# EAGLE design FluxamasynthStandalone_v1 (EAGLE 5.06)
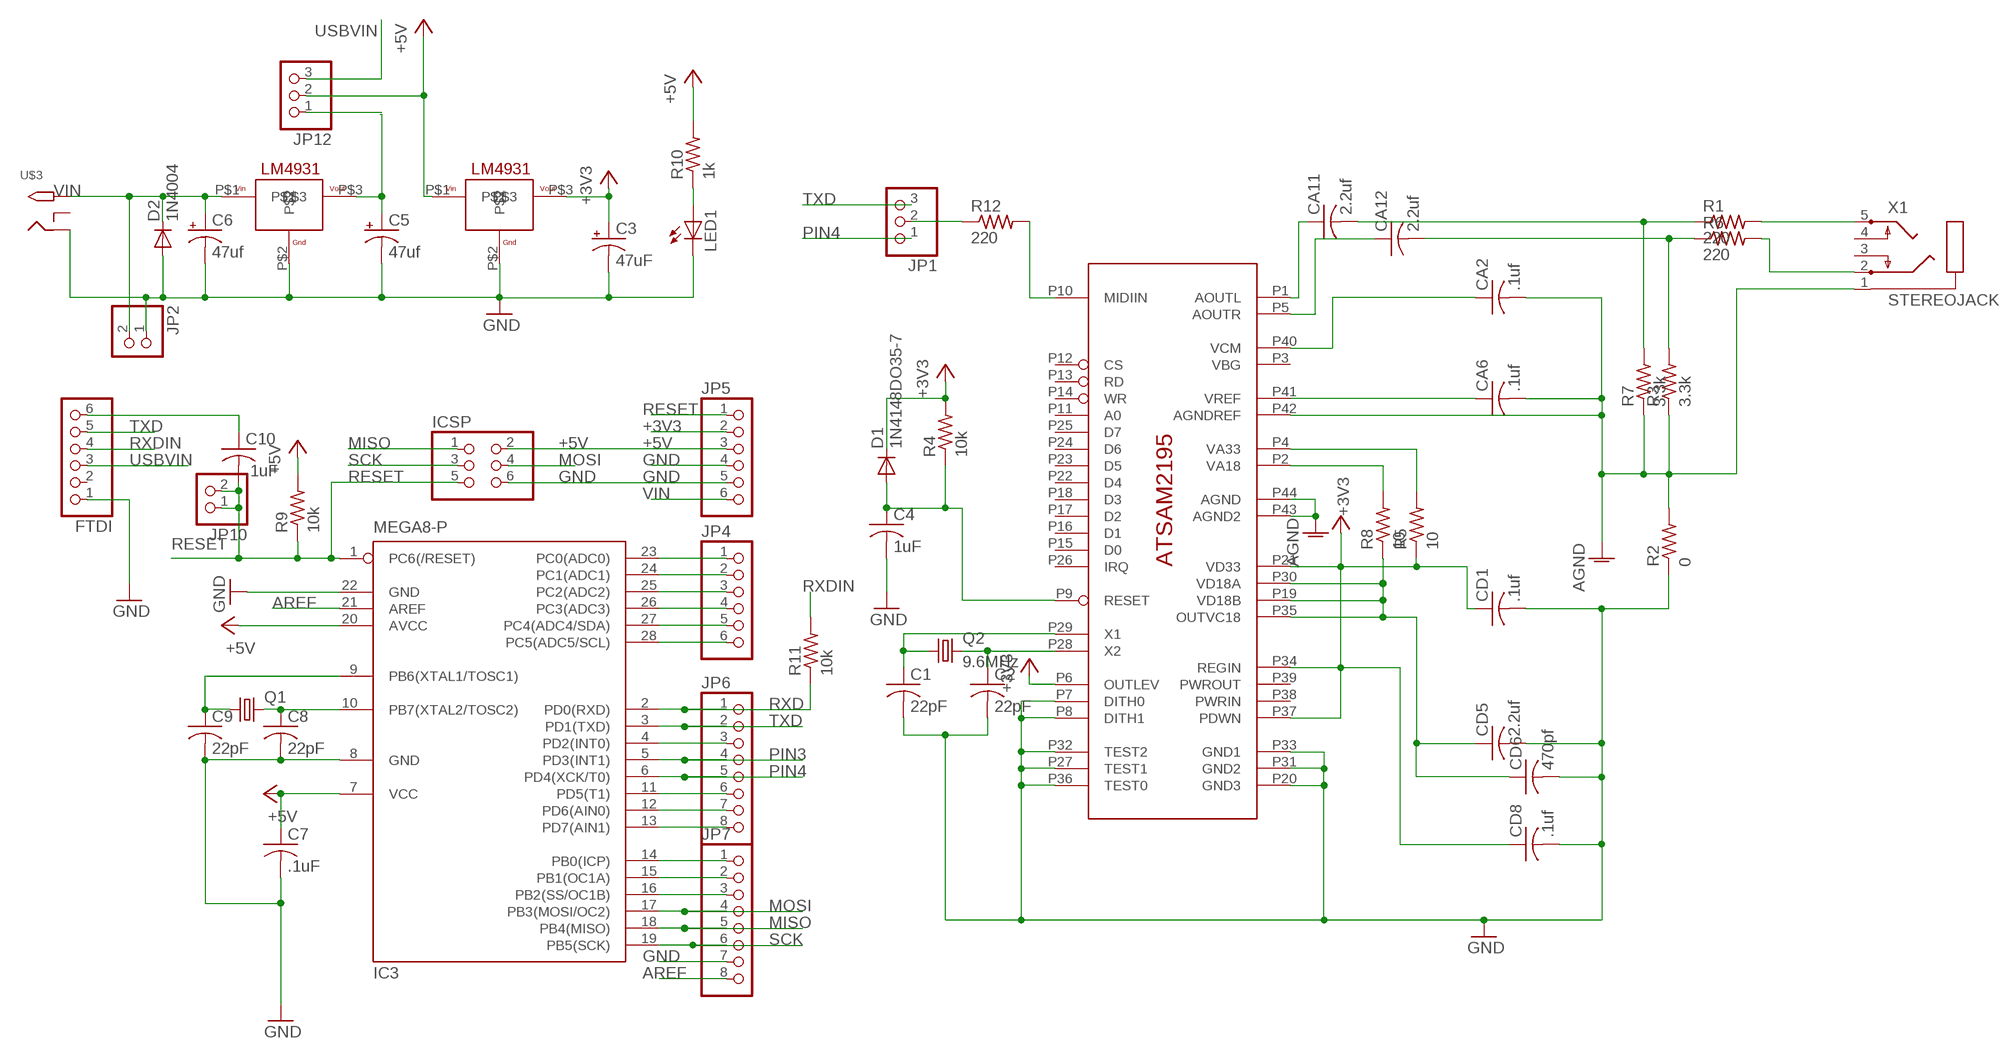
[diagram p0: schematic, sheet 1]

## Parts
C1  22pF  C-US025-025X050  [C025-025X050]
C2  22pF  C-US025-025X050  [C025-025X050]
C3  47uF  CPOL-USTT2D6  [TT2D6]
C4  1uF  C-US025-025X050  [C025-025X050]
C5  47uf  CPOL-USTT2D6  [TT2D6]
C6  47uf  CPOL-USTT2D6  [TT2D6]
C7  .1uF  C-US025-025X050  [C025-025X050]
C8  22pF  C-US025-025X050  [C025-025X050]
C9  22pF  C-US025-025X050  [C025-025X050]
C10  .1uF  C-US025-025X050  [C025-025X050]
CA2  .1uf  C-US025-025X050  [C025-025X050]
CA6  .1uf  C-US025-025X050  [C025-025X050]
CA11  2.2uf  C-US025-025X050  [C025-025X050]
CA12  2.2uf  C-US025-025X050  [C025-025X050]
CD1  .1uf  C-US025-025X050  [C025-025X050]
CD5  2.2uf  C-US025-025X050  [C025-025X050]
CD6  470pf  C-US025-025X050  [C025-025X050]
CD8  .1uf  C-US025-025X050  [C025-025X050]
D1  1N4148DO35-7  [DO35-7]
D2  1N4004  [DO41-10]
FTDI  PINHD-1X6  [1X06]
IC3  MEGA8-P  [DIL28-3]
ICSP  PINHD-2X3  [2X03]
JP1  PINHD-1X3  [1X03]
JP2  PINHD-1X2  [1X02]
JP4  PINHD-1X6  [1X06]
JP5  PINHD-1X6  [1X06]
JP6  PINHD-1X8  [1X08]
JP7  PINHD-1X8  [1X08]
JP10  PINHD-1X2  [1X02]
JP12  PINHD-1X3  [1X03]
LED1  LED3MM  [LED3MM]
Q1  CRYSTALHC49S  [HC49/S]
Q2  9.6MHz  CRYSTALTC26H  [TC26H]
R1  220  R-US_0207/7  [0207/7]
R2  0  R-US_0207/7  [0207/7]
R3  3.3k  R-US_0207/7  [0207/7]
R4  10k  R-US_0207/7  [0207/7]
R5  10  R-US_0207/7  [0207/7]
R6  220  R-US_0207/7  [0207/7]
R7  3.3k  R-US_0207/7  [0207/7]
R8  10  R-US_0207/7  [0207/7]
R9  10k  R-US_0207/7  [0207/7]
R10  1k  R-US_0207/7  [0207/7]
R11  10k  R-US_0207/7  [0207/7]
R12  220  R-US_0207/7  [0207/7]
U$1  ATSAM2195  [ATSAM2195]
U$2  LM4931  [LM4931TO92]
U$3  2.1MMJACK  [PJ-102A]
U$4  LM4931  [LM4931TO92]
X1  STEREOJACK  [STX3100]

## Nets
+3V3: C3.+ CD1.1 CD8.1 D1.C JP5.2 R4.2 R5.1 U$1.P6(OUTLEV) U$1.P21(VD33) U$1.P34(REGIN) U$1.P37(PDWN) U$4.P$3
+5V: C7.1 IC3.7(VCC) IC3.20(AVCC) ICSP.2 JP5.3 JP12.2 R9.2 R10.2 U$4.P$1
AGND: CA2.2 CA6.2 R2.2 R3.1 R7.1 U$1.P42(AGNDREF) U$1.P43(AGND2) U$1.P44(AGND) X1.1
AREF: IC3.21(AREF) JP7.8
CA11: CA12.1 U$1.P5(AOUTR)
GND: C1.2 C2.2 C3.- C4.2 C5.- C6.- C7.2 C8.2 C9.2 CD1.2 CD5.2 CD6.2 CD8.2 D2.A FTDI.1 IC3.8(GND) IC3.22(GND) ICSP.6 JP2.1 JP5.4 JP5.5 JP7.7 LED1.K(C) R2.1 U$1.P7(DITH0) U$1.P8(DITH1) U$1.P20(GND3) U$1.P27(TEST1) U$1.P31(GND2) U$1.P32(TEST2) U$1.P33(GND1) U$1.P36(TEST0) U$2.P$2 U$3.RING U$4.P$2
MISO: IC3.18(PB4(MISO)) ICSP.1 JP7.5
MOSI: IC3.17(PB3(MOSI/OC2)) ICSP.4 JP7.4
N$1: JP1.2 R12.1
N$2: R12.2 U$1.P10(MIDIIN)
N$3: C2.1 Q2.2 U$1.P28(X2)
N$4: C4.1 D1.A R4.1 U$1.P9(RESET)
N$5: C1.1 Q2.1 U$1.P29(X1)
N$6: CD5.1 CD6.1 R8.1 U$1.P19(VD18B) U$1.P30(VD18A) U$1.P35(OUTVC18)
N$7: R8.2 U$1.P2(VA18)
N$8: CA11.1 U$1.P1(AOUTL)
N$9: LED1.A R10.1
N$10: CA11.2 R1.1 R7.2
N$11: CA12.2 R3.2 R6.1
N$12: CA2.1 U$1.P40(VCM)
N$13: R5.2 U$1.P4(VA33)
N$14: R1.2 X1.5
N$15: IC3.23(PC0(ADC0)) JP4.1
N$16: R6.2 X1.2
N$17: C8.1 IC3.10(PB7(XTAL2/TOSC2)) Q1.2
N$18: JP12.1
N$19: C5.+ U$2.P$3
N$20: CA6.1 U$1.P41(VREF)
N$22: IC3.24(PC1(ADC1)) JP4.2
N$25: C9.1 IC3.9(PB6(XTAL1/TOSC1)) Q1.1
N$26: IC3.25(PC2(ADC2)) JP4.3
N$27: IC3.26(PC3(ADC3)) JP4.4
N$28: IC3.27(PC4(ADC4/SDA)) JP4.5
N$30: IC3.28(PC5(ADC5/SCL)) JP4.6
N$33: IC3.4(PD2(INT0)) JP6.3
N$34: C10.1 FTDI.6
N$36: IC3.11(PD5(T1)) JP6.6
N$37: IC3.12(PD6(AIN0)) JP6.7
N$38: IC3.13(PD7(AIN1)) JP6.8
N$39: IC3.14(PB0(ICP)) JP7.1
N$40: IC3.15(PB1(OC1A)) JP7.2
N$41: IC3.16(PB2(SS/OC1B)) JP7.3
PIN3: IC3.5(PD3(INT1)) JP6.4
PIN4: IC3.6(PD4(XCK/T0)) JP1.1 JP6.5
RESET: C10.2 IC3.1(PC6(/RESET)) ICSP.5 JP5.1 JP10.1 JP10.2 R9.1
RXD: IC3.2(PD0(RXD)) JP6.1 R11.1
RXDIN: FTDI.4 R11.2
SCK: IC3.19(PB5(SCK)) ICSP.3 JP7.6
TXD: FTDI.5 IC3.3(PD1(TXD)) JP1.3 JP6.2
USBVIN: FTDI.3 JP12.3
VIN: C6.+ D2.C JP2.2 JP5.6 U$2.P$1 U$3.TIP
Unconnected: FTDI.2 U$1.P3(VBG) U$1.P11(A0) U$1.P12(CS) U$1.P13(RD) U$1.P14(WR) U$1.P15(D0) U$1.P16(D1) U$1.P17(D2) U$1.P18(D3) U$1.P22(D4) U$1.P23(D5) U$1.P24(D6) U$1.P25(D7) U$1.P26(IRQ) U$1.P38(PWRIN) U$1.P39(PWROUT) U$3.RING_SW X1.3 X1.4

## Library data of the parts
C1 C2 C4 C7-C10 CA2 CA6 CA11 CA12 CD1 CD5 CD6 CD8 = adafruit:C-US: CAPACITOR, American symbol
C3 C5 C6 = adafruit:CPOL-US: POLARIZED CAPACITOR, American symbol
D1 = diode:1N4148: DIODE high speed (Philips)
D2 = adafruit:1N4004: DIODE General purpose 1N400x type rectifier (With bigger pads) http://www.ladyada.net/library/pcb/eaglelibrary.html
FTDI JP4 JP5 = pinhead:PINHD-1X6: PIN HEADER
IC3 = atmel:MEGA8-P: MICROCONTROLLER 8 Kbytes FLASH, 1 kbytes SRAM, 512 bytes EEPROM, USART, 4-channel 10 bit ADC, 2-channel 8 bit ADC Pin compatible with Atmega48, ATMega88, ATMega168 Source: avr.lbr
ICSP = pinhead:PINHD-2X3: PIN HEADER
JP1 JP12 = pinhead:PINHD-1X3: PIN HEADER
JP2 JP10 = pinhead:PINHD-1X2: PIN HEADER
JP6 JP7 = pinhead:PINHD-1X8: PIN HEADER
LED1 = led:LED: LED OSRAM: - CHIPLED LG R971, LG N971, LY N971, LG Q971, LY Q971, LO R971, LY R971 LH N974, LH R974 LS Q976, LO Q976, LY Q976 LO Q996 - Hyper CHIPLED LW Q18S LB Q993, LB Q99A, LB R99A - SideLED LS A670, LO A670, LY A670, LG A670, LP A670 LB A673, LV A673, LT A673, LW A673 LH A674 LY A675 LS A676, LA A676, LO A676, LY A676, LW A676 LS A679, LY A679, LG A679 - Hyper Micro SIDELED® LS Y876, LA Y876, LO Y876, LY Y876 LT Y87S - SmartLED LW L88C, LW L88S LB L89C, LB L89S, LG L890 LS L89K, LO L89K, LY L89K LS L896, LA L896, LO L896, LY L896 - TOPLED LS T670, LO T670, LY T670, LG T670, LP T670 LSG T670, LSP T670, LSY T670, LOP T670, LYG T670 LG T671, LOG T671, LSG T671 LB T673, LV T673, LT T673, LW T673 LH T674 LS T676, LA T676, LO T676, LY T676, LB T676, LH T676, LSB T676, LW T676 LB T67C, LV T67C, LT T67C, LS T67K, LO T67K, LY T67K, LW E67C LS E67B, LA E67B, LO E67B, LY E67B, LB E67C, LV E67C, LT E67C LW T67C LS T679, LY T679, LG T679 LS T770, LO T770, LY T770, LG T770, LP T770 LB T773, LV T773, LT T773, LW T773 LH T774 LS E675, LA E675, LY E675, LS T675 LS T776, LA T776, LO T776, LY T776, LB T776 LHGB T686 LT T68C, LB T68C - Hyper Mini TOPLED® LB M676 - Mini TOPLED Santana® LG M470 LS M47K, LO M47K, LY M47K Source: http://www.osram.convergy.de LUXEON: - LUMILED® LXK2-PW12-R00, LXK2-PW12-S00, LXK2-PW14-U00, LXK2-PW14-V00 LXK2-PM12-R00, LXK2-PM12-S00, LXK2-PM14-U00 LXK2-PE12-Q00, LXK2-PE12-R00, LXK2-PE12-S00, LXK2-PE14-T00, LXK2-PE14-U00 LXK2-PB12-K00, LXK2-PB12-L00, LXK2-PB12-M00, LXK2-PB14-N00, LXK2-PB14-P00, LXK2-PB14-Q00 LXK2-PR12-L00, LXK2-PR12-M00, LXK2-PR14-Q00, LXK2-PR14-R00 LXK2-PD12-Q00, LXK2-PD12-R00, LXK2-PD12-S00 LXK2-PH12-R00, LXK2-PH12-S00 LXK2-PL12-P00, LXK2-PL12-Q00, LXK2-PL12-R00 Source: www.luxeon.com KINGBRIGHT: KA-3528ASYC Source: www.kingbright.com
Q1 Q2 = crystal:CRYSTAL: CRYSTAL
R1-R12 = adafruit:R-US_: RESISTOR, American symbol
U$1 = ATSAM2195:ATSAM2195
U$2 U$4 = LM4931:LM4931
U$3 = adafruit:2.1MMJACK: 2.1mm x 5.5mm DC jack with internal switch. Digikey part #PJ-102A, 4UCON part #05537 By microbuilder.eu
X1 = adafruit:STEREOJACK: MIC/HEADPHONE JACK Stereo jack with two switches. Kycon STX3100, CUI SJ1-3555NG and/or 4UCon 05544

## Board
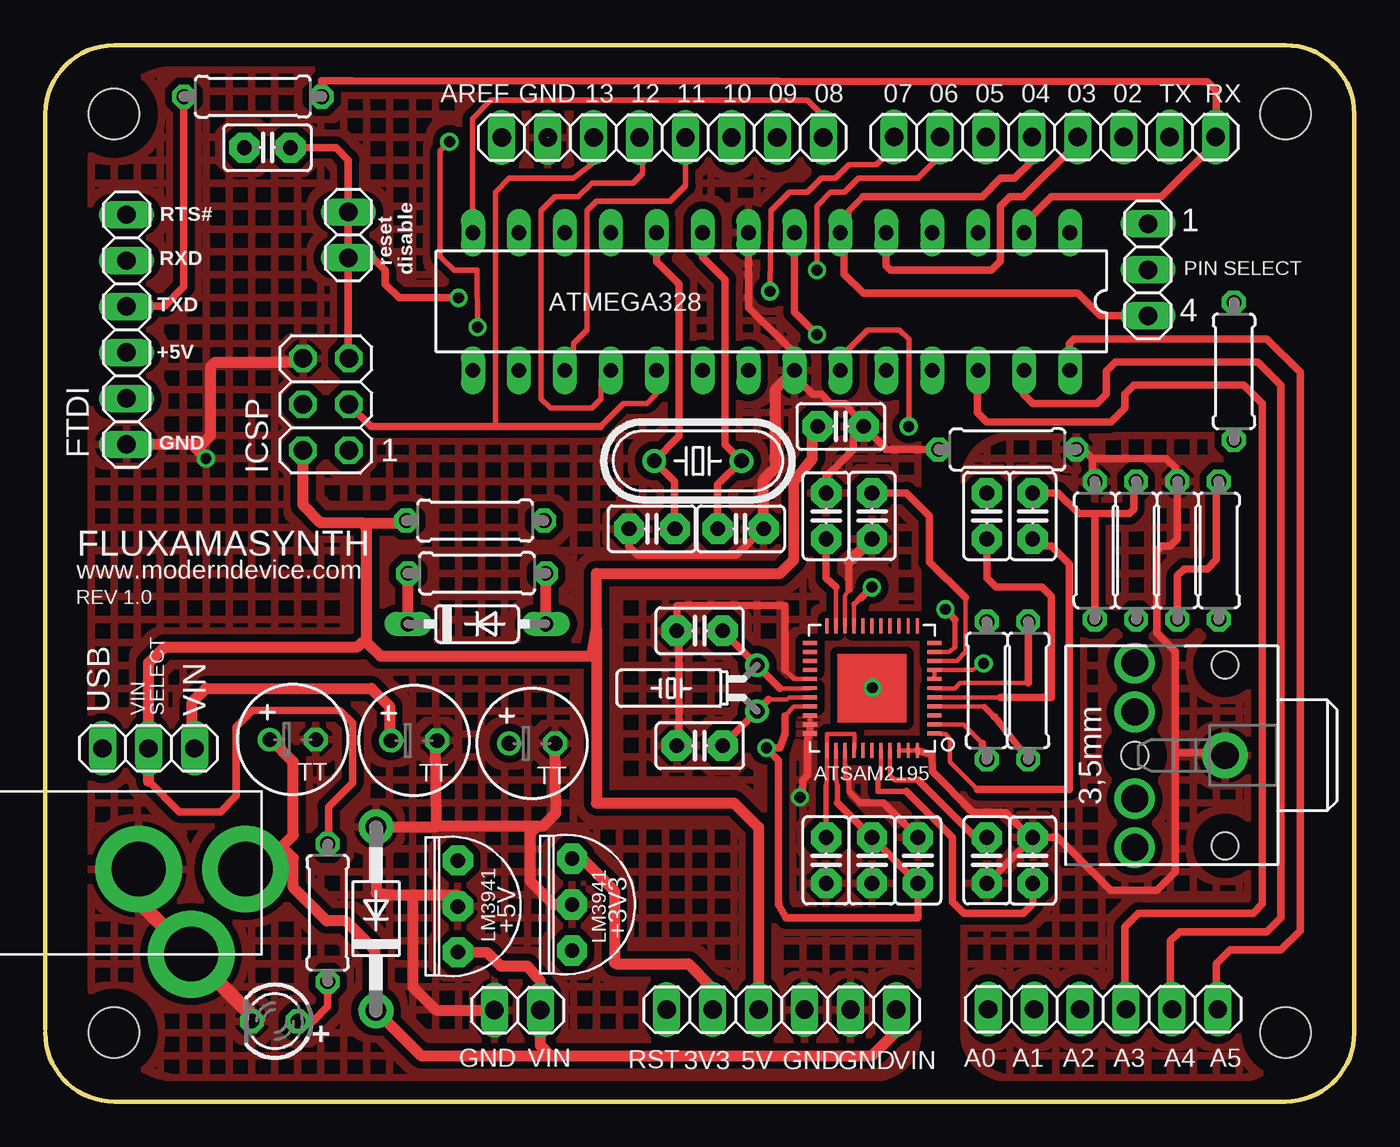
[diagram p1: board, top side]
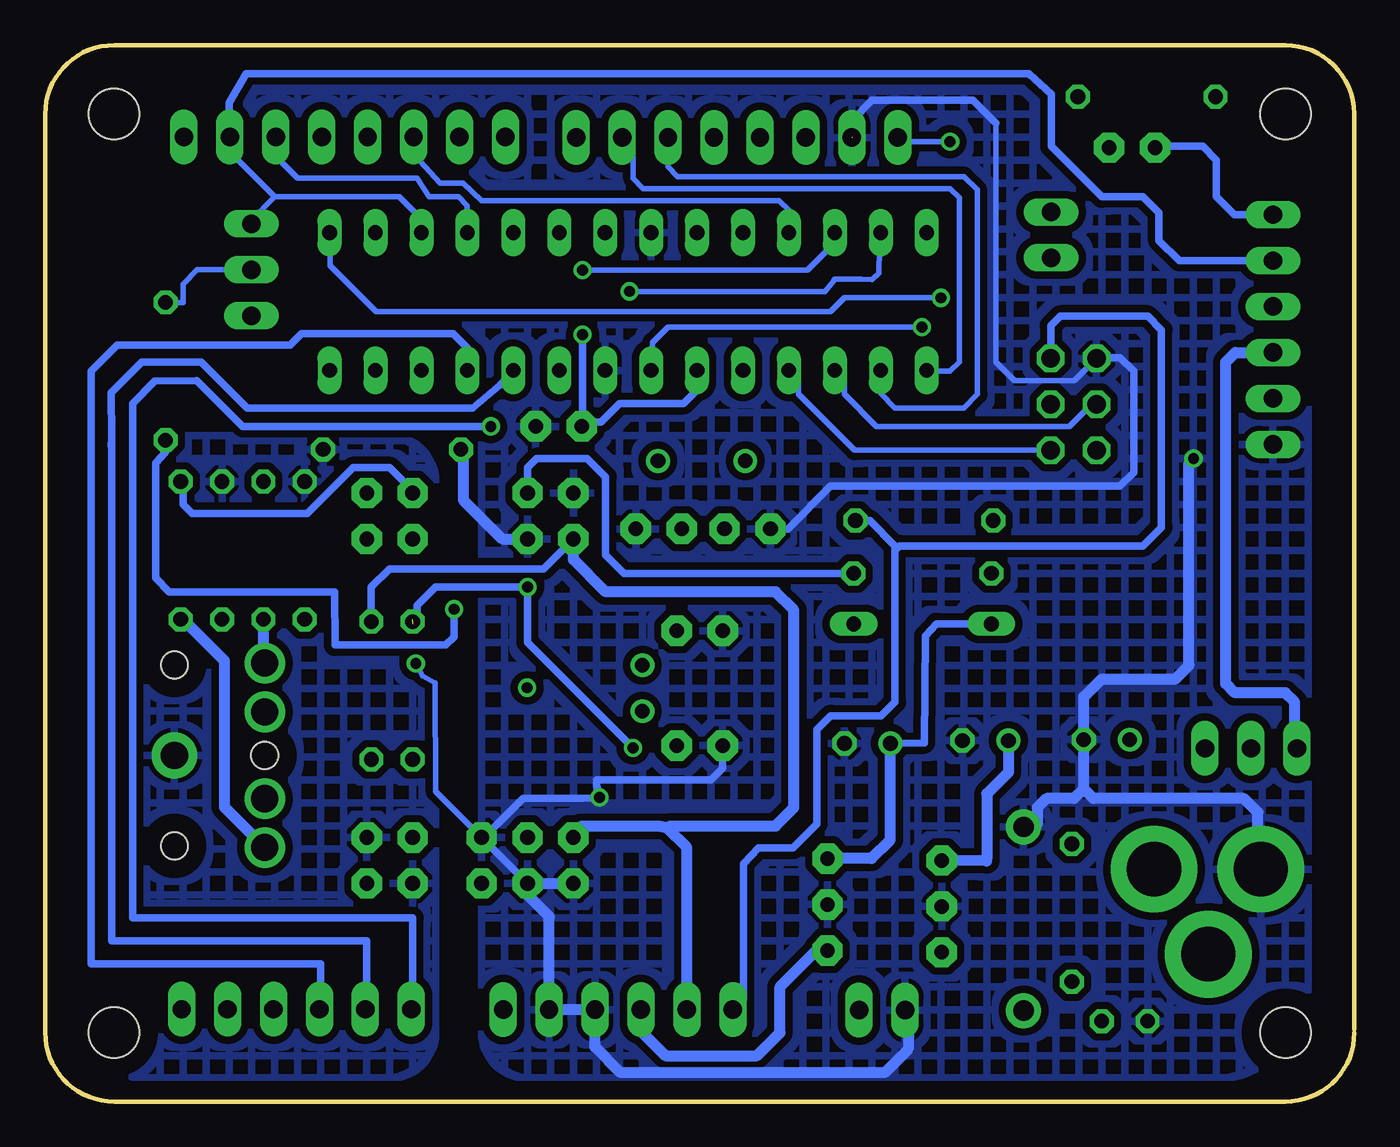
[diagram p2: board, bottom side, seen from below]

Size 72.39 x 58.42 mm. Coordinates in mm from the lower left corner, seen from the top.
Outline: 0,54.64 arc-90 3.81,58.42 68.58,58.42 arc-90 72.39,54.61 72.39,3.81 arc-90 68.58,0 3.81,0 arc-90 0,3.81
Outline: 0,54.64 arc0 0,54.61
Outline: 0,54.64 0,3.99
Copper layers (1*16): Top 0.035mm / dielectric 1.5mm / Bottom 0.035mm
Design rules "default": minimum track width 10mil, minimum drill 24mil, track to track 8mil, track to pad 8mil, pad to pad 8mil, via to via 8mil, smd to smd 8mil, copper to edge 40mil, drill to drill 8mil, minimum pad ring 10mil, minimum via ring 8mil, stop-mask expansion 4mil, vias tented up to drill 0mil, thermal gap 10mil
Holes 2.8 mm at 3.81,54.61 3.81,3.81 68.58,3.81 68.58,54.61

### Footprints (pad centres in the part's own frame; a part is rotated, then mirrored left to right if it is on the bottom)
C025-025X050 = drill 0.813 pad 1.676 octagon: 1 -1.27,0; 2 1.27,0
TT2D6 = drill 0.813 round: + -1.27,0 | drill 0.813 octagon: - 1.27,0
DO35-7 = drill 0.813 long: A 3.81,0; C -3.81,0
DO41-10 = drill 1.118 pad 1.93 round: A 5.08,0; C -5.08,0
1X06 = drill 1.016 long: 1 -6.35,0; 2 -3.81,0; 3 -1.27,0; 4 1.27,0; 5 3.81,0; 6 6.35,0
DIL28-3 = drill 0.813 long: 1 -16.51,-3.81; 2 -13.97,-3.81; 3 -11.43,-3.81; 4 -8.89,-3.81; 5 -6.35,-3.81; 6 -3.81,-3.81; 7 -1.27,-3.81; 8 1.27,-3.81; 9 3.81,-3.81; 10 6.35,-3.81; 11 8.89,-3.81; 12 11.43,-3.81; 13 13.97,-3.81; 14 16.51,-3.81; 15 16.51,3.81; 16 13.97,3.81; 17 11.43,3.81; 18 8.89,3.81; 19 6.35,3.81; 20 3.81,3.81; 21 1.27,3.81; 22 -1.27,3.81; 23 -3.81,3.81; 24 -6.35,3.81; 25 -8.89,3.81; 26 -11.43,3.81; 27 -13.97,3.81; 28 -16.51,3.81
2X03 = drill 1.016 octagon: 1 -2.54,-1.27; 2 -2.54,1.27; 3 0,-1.27; 4 0,1.27; 5 2.54,-1.27; 6 2.54,1.27
1X03 = drill 1.016 long: 1 -2.54,0; 2 0,0; 3 2.54,0
1X02 = drill 1.016 long: 1 -1.27,0; 2 1.27,0
1X08 = drill 1.016 long: 1 -8.89,0; 2 -6.35,0; 3 -3.81,0; 4 -1.27,0; 5 1.27,0; 6 3.81,0; 7 6.35,0; 8 8.89,0
LED3MM = drill 0.813 octagon: A -1.27,0; K 1.27,0
HC49/S = drill 0.813 round: 1 -2.413,0; 2 2.413,0
TC26H = drill 0.813 round: 1 -1.27,0; 2 1.27,0
0207/7 = drill 0.813 octagon: 1 -3.81,0; 2 3.81,0
ATSAM2195 = smd 0.813 x 0.203: P1 -3.441,2.5; P2 -3.441,2; P3 -3.441,1.5; P4 -3.441,1; P5 -3.441,0.5; P6 -3.441,0; P7 -3.441,-0.5; P8 -3.441,-1; P9 -3.441,-1.5; P10 -3.441,-2; P11 -3.441,-2.5; P23 3.441,-2.5; P24 3.441,-2; P25 3.441,-1.5; P26 3.441,-1; P27 3.441,-0.5; P28 3.441,0; P29 3.441,0.5; P30 3.441,1; P31 3.441,1.5; P32 3.441,2; P33 3.441,2.5 | smd 0.203 x 0.813: P12 -2.5,-3.441; P13 -2,-3.441; P14 -1.5,-3.441; P15 -1,-3.441; P16 -0.5,-3.441; P17 0,-3.441; P18 0.5,-3.441; P19 1,-3.441; P20 1.5,-3.441; P21 2,-3.441; P22 2.5,-3.441; P34 2.5,3.441; P35 2,3.441; P36 1.5,3.441; P37 1,3.441; P38 0.5,3.441; P39 0,3.441; P40 -0.5,3.441; P41 -1,3.441; P42 -1.5,3.441; P43 -2,3.441; P44 -2.5,3.441
LM4931TO92 = drill 0.8 pad 1.676 octagon: P$1 -2.54,0; P$2 0,0; P$3 2.54,0
PJ-102A = drill 3 pad 4.8 round: RING 0.1,-3.39; RING_SW -4.6,-6.29; TIP 0.1,-9.29
STX3100 = drill 1.5 pad 2.54 round: 1 2.7,-0.1 | drill 1.5 round: 2 7.7,5; 3 7.7,2.3; 4 7.7,-2.5; 5 7.7,-5.2 | hole 1.5: 2.7,4.9; 2.7,-5.1; 7.7,-0.1

### Placement (x,y rotation side)
C1  36.2,19.68 180 top
C2  36.2,26.04 180 top
C3  26.92,19.81 0 top
C4  45.72,32.38 270 top
C5  20.4,19.96 0 top
C6  13.69,20.02 0 top
C7  43.99,37.34 0 top
C8  33.55,31.67 180 top
C9  38.46,31.67 0 top
C10  12.29,52.76 0 top
CA2  54.61,13.33 90 top
CA6  52.07,13.33 270 top
CA11  54.61,32.38 90 top
CA12  52.07,32.38 90 top
CD1  43.18,32.38 90 top
CD5  48.26,13.33 90 top
CD6  45.72,13.33 270 top
CD8  43.18,13.33 270 top
D1  23.88,26.42 0 top
D2  18.29,10.11 90 top
FTDI  4.5,42.7 90 top
IC3  40.16,44.25 180 top
ICSP  15.52,38.56 90 top
JP1  60.99,46 90 top
JP2  26.11,5.05 0 top
JP4  58.5,5.11 0 top
JP5  40.72,5.08 0 top
JP6  55.83,53.34 180 top
JP7  34.14,53.31 180 top
JP10  16.76,47.93 90 top
JP12  5.72,19.53 180 top
LED1  12.7,4.45 180 top
Q1  36.09,35.43 180 top
Q2  39.37,22.86 90 top
R1  60.33,30.48 270 top
R2  53.21,36.07 0 top
R3  62.61,30.48 270 top
R4  23.88,29.21 180 top
R5  54.36,22.73 270 top
R6  64.9,30.48 270 top
R7  58.04,30.48 270 top
R8  52.07,22.73 270 top
R9  23.77,32.13 180 top
R10  15.62,10.44 90 top
R11  11.48,55.58 180 top
R12  65.74,40.39 270 top
U$1  45.72,22.86 180 top
U$2  22.81,10.79 90 top
U$3  1.78,12.75 90 top
U$4  29.13,10.9 90 top
X1  67.95,19.05 180 top

### Tracks (layer width: path | path; a pad name or v marks a point on that pad's centre or on a via)
+3V3
  Top 0.254: 43.18,17.46 43.22,17.82 U$1.P34 43.22,20.34 | 54.38,23.14 50.57,23.14 50.29,22.86 U$1.P6 | 43.71,28.45 43.71,26.14 U$1.P21 | U$1.P37 44.76,19.55 44.76,20.32 43.22,20.34 | 43.23,20.22 43.22,20.34
  Top 0.305: CD8.1 43.18,17.46
  Top 0.406: R5.1 54.38,23.14 | 43.71,28.45 43.18,28.96 CD1.1
  Top 0.61: C3.+ 25.65,20.07 | D1.C R4.2 | JP5.2 36.83,5.16 36.83,6.35 35.56,7.62 31.55,7.62 31.47,7.7 31.47,11.66 29.69,13.44 U$4.P$3
  Bottom 0.406: CD1.1 44.83,29.46 53.34,29.46 54.36,28.45 R5.1 | D1.C 23.11,26.42 23.72,25.76 23.77,19.84 C3.+
  Bottom 0.61: JP5.2 36.91,14.05 37.97,15.11 | 37.97,15.11 38.35,15.21 42.8,15.21 CD8.1 | C3.+ 25.65,14.48 26.7,13.44 U$4.P$3 | CD1.1 43.18,29.97 41.4,28.19 32,28.19 30.99,27.18 30.99,16.26 32,15.24 37.85,15.24 37.97,15.11
+5V  (via drill 0.6)
  Top 0.406: IC3.7 41.43,43.66 v42.67,42.42 | 19.84,32 R9.2 | 5.72,17.73 7.42,16.03 9.7,16.03 10.57,16.89 10.57,20.73 11.48,21.64 16.28,21.64 16.99,20.93 16.99,17.63 15.67,16.31 15.67,14.3
  Top 0.61: JP5.3 39.45,15.16 38.1,16.51 30.48,16.51 30.48,26.16 | 30.48,26.16 30.48,29.21 40.64,29.21 41.4,29.97 41.4,34.29 42.42,35.56 42.42,37.03 C7.1 | 17.53,32 19.84,32 | 17.78,25.4 17.53,25.4 17.27,25.15 6.6,25.15 5.72,24.26 JP12.2 5.72,17.73 | 17.78,25.4 18.54,24.64 30.23,24.64 30.48,26.16 | 17.78,25.4 17.78,31.75 17.53,32 | ICSP.2 14.25,33 15.24,32 17.53,32 | 15.67,14.3 R10.2
  Bottom 0.406: IC3.20 36.35,39.35 37.08,38.61 40.64,38.61 41.66,37.59 42.47,37.59 C7.1 42.67,37.39 v42.67,42.42
  Bottom 0.61: U$4.P$1 29.74,8.36 31.75,6.35 31.75,3.81 33.02,2.54 38.1,2.54 39.37,3.81 39.37,5 JP5.3
AGND
  Top 0.254: U$1.P44 U$1.P43 U$1.P42
  Top 0.406: CA6.2 CA2.2 | R2.2 57.4,36.07 57.91,35.56 | 58.04,34.42 R7.1 57.91,34.42 57.91,35.56 | 62.48,19.3 62.48,24.89 61.47,25.91 61.47,30.48 61.72,30.73 62.23,30.73 62.61,31.11 R3.1 62.48,34.42 62.48,35.05 61.98,35.56 57.91,35.56 | 62.48,19.3 65.09,19.3 X1.1 | CA2.2 56.01,14.61 58.93,11.68 61.47,11.68 62.48,12.7 62.48,19.3 | CA2.2 54.48,14.61 53.09,16 51.31,16 49.07,18.26 49.02,19.16 U$1.P44
  pour Top (isolate 0.406, hatched): 63.5,1.27 53.34,1.27 arc-90 50.8,3.81 50.8,29.21 50.8,34.29 arc-90 53.34,36.83 66.04,36.83 arc-90 68.58,34.29 68.58,3.81 arc-90 66.04,1.27
  pour Bottom (isolate 0.406, hatched): 66.04,1.27 53.34,1.27 arc-90 50.8,3.81 50.8,34.29 arc-90 53.34,36.83 66.04,36.83 arc-90 69.09,33.53 69.09,3.05 arc-90
AREF  (via drill 0.6)
  Top 0.305: v23.9,42.82 23.88,45.97 22.61,45.97 21.84,46.74 21.84,52.58 v22.35,53.09
  Bottom 0.305: IC3.21 38.81,41.99 37.95,42.82 v23.9,42.82 | v22.35,53.09 25.02,53.09 JP7.8
CA11
  Top 0.254: U$1.P5 52.82,22.36 52.83,22.35
  Top 0.406: 52.83,22.35 55.63,22.35 55.63,27.94 55.12,28.45 52.58,28.45 52.07,28.96 CA12.1
GND  (via drill 0.6)  (1 unrouted)
  Top 0.254: U$1.P7 U$1.P8 51.27,23.86 v51.89,24.23 | U$1.P36 44.22,18.01 44.45,17.78 | U$1.P20 44.22,27.96 44.45,28.32 | U$1.P32 U$1.P31 | U$1.P27 41.41,23.36 40.89,23.88
  Top 0.305: 45.09,16.51 44.45,17.14 44.45,17.78 | IC3.22 41.43,40.36
  Top 0.406: CD5.2 46.36,16.51 45.09,16.51 | 44.45,29.84 44.45,28.32 | U$1.P32 U$1.P33 42.16,20.05 42.16,18.03 41.91,17.78 41.91,17.53 v41.73,16.82 | 40.89,23.88 40.89,27.43 34.93,27.43 | 34.93,27.43 C2.2 | IC3.8 38.89,43.92 41.15,41.66 41.15,40.72 IC3.22 | C7.2 44.25,38.61 43.43,38.61 42.93,39.12 42.42,39.12 41.43,40.11 41.43,40.36 | CD1.2 43.18,34.54 44.7,36.07 44.7,36.78 C7.2 | R2.1 46.48,36.07 46.48,36.12 C7.2 | 34.93,27.43 34.93,26.29 35.05,25.65 35.05,20.32 C1.2 | C8.2 32.28,30.76 32.26,30.73 32.77,30.23 38.23,30.23 C9.2 | 4.8,12.38 4.75,12.43
  Top 0.61: JP2.1 21.62,5.05 20.32,6.35 20.32,11.43 | 20.32,11.43 19.05,11.43 18.29,11.56 D2.A 21.54,15.19 21.64,15.24 | 21.64,15.24 21.59,19.89 C5.- | 21.64,15.24 27.23,15.24 | 27.23,15.24 27.53,15.24 28.25,15.95 C3.- 28.32,19.68 | C4.2 44.45,29.84 | C9.2 39.73,34.39 40.39,35.05 40.39,39.4 IC3.22 | 8.13,36.35 FTDI.1 | 8.13,36.35 8.66,36.35 9.14,36.83 9.14,40.64 9.4,40.89 14.05,40.89 ICSP.6 | v8.89,35.56 8.89,35.59 8.13,36.35 | U$2.P$2 22.73,10.82 22.76,11.43 20.32,11.43 | U$4.P$2 28.12,10.9 26.82,12.19 26.82,14.83 27.23,15.24
  Top 0.813: 4.75,12.43 U$3.RING | LED1.K 11.43,4.78 4.8,11.4 4.8,12.38
  Bottom 0.305: v51.89,24.23 51.51,23.55 50.83,23.14 50.8,17.14 CD5.2 | 19.81,54.1 19.81,40.89 18.8,39.88 15.47,39.88 ICSP.6
  Bottom 0.406: CD6.2 CD5.2 48.13,14.61 45.97,16.76 42.67,16.76 v41.73,16.82 41.91,17.53 41.91,17.78 35.56,17.78 34.93,18.41 C1.2 | C8.2 31.32,31.67 28.96,34.04 12.95,34.04 12.19,34.8 12.19,40.39 12.95,41.15 14.2,41.15 ICSP.6 | 27.79,53.34 27.79,54.25 26.67,55.37 21.08,55.37 19.81,54.1
  Bottom 0.61: C4.2 47.12,31.11 49.28,33.27 49.28,35.94 R2.1 | v8.89,35.56 9.14,35.31 9.14,24.13 9.91,23.37 13.97,23.37 14.96,22.38 C6.- 14.96,17.3 | U$3.RING 5.33,13.02 5.33,16 6.1,16.76 14.43,16.76 14.96,17.3 | 14.96,17.3 15.49,16.76 17.02,16.76 17.53,16.26 17.53,15.32 D2.A | CD8.2 CD6.2 45.72,11.43 44.53,10.24 JP5.5 JP5.4 | JP5.4 41.66,5.41 | JP5.4 41.99,3.02 40.56,1.6 25.96,1.6 24.66,2.9 24.66,4.88 JP2.1
  pour Top (isolate 0.406, hatched): 27.94,57.15 7.62,57.15 arc90 2.54,52.07 2.54,6.35 arc90 7.62,1.27 45.72,1.27 arc90 48.26,3.81 48.26,36.83 arc-90 50.8,39.37 63.5,39.37 arc90 68.58,44.45 68.58,52.07 arc90 63.5,57.15
  pour Bottom (isolate 0.406, hatched): 63.5,57.15 7.62,57.15 arc90 2.54,52.07 2.54,6.35 arc90 7.62,1.27 45.72,1.27 arc90 48.26,3.81 48.26,36.83 arc-90 50.8,39.37 63.5,39.37 arc90 68.58,44.45 68.58,52.07 arc90
MISO
  Top 0.305: IC3.18 30.73,39.9 30.73,38.86 30.23,38.35 27.94,38.35 27.43,38.86 27.43,49.28 28.19,50.04 29.46,50.04 30.23,50.8 32.51,50.8 33.02,51.31 33.02,53.16 JP7.5
  Bottom 0.305: ICSP.1 27.64,36.02 30.73,39.12 30.73,39.9 IC3.18
MOSI
  Top 0.305: JP7.4 35.41,50.65 34.54,49.78 30.48,49.78 29.97,49.28 29.97,42.67 29.21,41.91 29.21,40.92 IC3.17
  Bottom 0.305: ICSP.4 14.53,38.56 15.75,37.34 26.42,37.34 28.19,39.12 28.19,39.9 IC3.17
N$1
  Bottom 0.305: JP1.2 63.98,46 64.77,45.21 64.77,44.2 R12.1
N$2  (via drill 0.6)
  Top 0.254: U$1.P10 50.01,24.86 50.29,25.15
  Top 0.305: 50.29,25.15 50.29,26.67
  Top 0.406: 50.29,26.67 v49.78,27.23
  Bottom 0.406: R12.2 65.76,35.89 66.29,35.31 66.29,28.96 65.53,28.19 56.39,28.19 56.36,25.25 50.24,25.25 49.78,25.7 v49.78,27.23
N$3
  Top 0.254: U$1.P28 40.64,22.86
  Top 0.406: C2.1 Q2.2 40.64,22.86
N$4
  Top 0.254: 50.88,27.89 50.88,24.87 50.42,24.36 48.99,24.36 U$1.P9 | C4.1 45.72,33.53
  Top 0.406: C4.1 47.63,33.66 48.9,32.38 48.9,29.84 50.88,27.89
  Top 0.61: D1.A R4.1
  Bottom 0.406: R4.1 40.39,29.21 41.4,30.23 41.4,34.54 42.42,35.56 45.21,35.56 45.72,35.05 C4.1
N$5
  Top 0.254: 40.01,22.22 41.02,22.22 41.15,22.35 42.46,22.35 U$1.P29
  Top 0.406: C1.1 Q2.1 40.01,22.22
N$6  (via drill 0.6)  (2 unrouted)
  Top 0.254: U$1.P35 43.72,17.88 43.82,17.46 | U$1.P30 41.42,21.86 40.89,21.34 | 44.72,27.52 U$1.P19
  Top 0.305: 43.82,16.51 43.82,17.46 | 44.72,27.52 44.77,27.55 45.06,27.84 45.11,27.84
  Top 0.406: 43.82,16.51 CD6.1 CD5.1 48.26,10.16 40.97,10.16 40.56,10.85 40.56,10.97 40.54,10.87 40.54,18.87 v39.88,19.56 40.64,19.56 40.89,20.32 40.89,21.34 | v45.72,28.45 45.11,27.84
  Bottom 0.406: R8.1 51.82,26.8 51.82,27.43 50.8,28.45 v45.72,28.45 45.72,25.4 v39.88,19.56
N$7
  Top 0.254: U$1.P2 50.77,20.86 51.82,19.81
  Top 0.406: 51.82,19.81 51.82,19.18 R8.2
N$8
  Top 0.254: U$1.P1 49.49,20.36 49.53,20.32 49.78,20.32 50.04,20.07 50.04,18.8 51.56,17.27
  Top 0.406: 51.56,17.27 56.64,17.27 56.64,29.72 55.63,30.73 54.99,30.73 CA11.1
N$9
  Top 0.406: LED1.A 14.81,4.45 15.62,5.26 R10.1
N$10
  Top 0.406: CA11.2 56.01,33.66 57.15,32.51 57.91,32.51 | 57.91,32.51 59.94,32.51 60.2,32.77 60.2,34.16 R1.1 | R7.2 58.04,32.38 57.91,32.51
N$11
  Top 0.406: R6.1 64.77,34.16 64.77,29.97 64.26,29.46 62.99,29.46 62.61,29.08 R3.2
  Bottom 0.406: CA12.2 52.07,33.78 53.34,35.05 55.37,35.05 57.91,32.51 64.26,32.51 64.77,33.02 64.77,34.16 R6.1
N$12
  Top 0.254: U$1.P40 46.22,17.96 46.04,17.78
  Top 0.305: 47.63,17.14 46.04,17.14 46.04,17.78
  Top 0.406: 47.63,17.14 50.17,14.61 50.17,11.05 50.8,10.41 54.1,10.41 54.61,10.92 CA2.1
N$13
  Top 0.254: U$1.P4 51.93,21.86
  Top 0.305: 51.93,21.86 51.93,21.84 52.5,21.26
  Top 0.406: 52.5,21.26 52.53,21.26 R5.2
N$14
  Bottom 0.305: 60.33,24.33 X1.5
  Bottom 0.61: R1.2 60.33,24.33
N$15  (via drill 0.6)
  Top 0.305: IC3.23 43.97,41.17 45.47,42.67 47.24,42.67 47.75,42.16 v47.75,37.34
  Bottom 0.406: JP4.1 52.07,5.11 52.07,10.16 67.56,10.16 67.56,38.61 66.35,39.85 64.01,39.88 61.47,37.34 v47.75,37.34
N$16
  Bottom 0.406: R6.2 64.77,26.67
  Bottom 0.61: 64.77,26.67 62.48,24.38 62.48,16.29 X1.2
N$17
  Top 0.406: IC3.10 33.81,46.46 35.05,45.21 35.05,36.8 Q1.2 33.68,35.41 34.8,34.29 34.8,31.7 C8.1
N$19
  Top 0.61: 8.13,19.18 8.13,22.1 8.89,22.86 18.03,22.86 19.05,21.84 19.05,20.04 C5.+
  Bottom 0.406: 20.32,13.41 20.32,13.31
  Bottom 0.61: C5.+ 19.13,18.21 20.32,17.02 20.32,13.41 | 20.32,13.31 U$2.P$3
N$20
  Top 0.254: U$1.P41 46.72,18.05 46.99,17.78
  Top 0.305: 46.99,17.78 48.26,17.78
  Top 0.406: CA6.1 51.44,14.61 48.26,17.78
N$22
  Bottom 0.406: JP4.2 54.61,5.11 54.61,8.89 68.71,8.89 68.71,36.73 | 68.71,36.73 68.73,36.25 | IC3.24 46.48,40.41 47.24,39.62 48.77,38.35 61.21,38.35 63.75,40.89 67.06,40.89 68.73,39.22 68.71,36.73
N$25
  Top 0.406: IC3.9 36.35,46.71 37.59,45.47 37.59,36.35 Q1.1 37.19,34.11 C9.1
N$26
  Bottom 0.305: IC3.25 49.02,40.46
  Bottom 0.406: JP4.3 57.15,5.11 57.15,7.62 69.85,7.62 69.85,40.39 68.4,41.83 58.85,41.83 58.22,42.47 49.84,42.47 49.02,41.66 49.02,40.46 | IC3.25 49.02,40.41
N$27
  Top 0.406: 59.69,5.11 JP4.4 59.69,5.18 59.69,9.65 60.45,10.41 66.8,10.41 67.31,10.92 67.31,38.61 66.29,39.62 60.2,39.62 59.69,39.12 59.69,38.35 58.93,37.59 52.07,37.59 51.56,38.1 51.56,40.41 IC3.26
N$28
  Top 0.406: JP4.5 62.23,5.11 62.23,8.89 62.74,9.4 67.56,9.4 68.33,10.16 68.33,27.43 | 68.33,27.43 68.33,27.91 | 68.33,27.43 68.33,39.62 67.06,40.89 59.18,40.89 58.67,40.39 58.67,39.12 58.17,38.61 54.61,38.61 54.1,39.12 54.1,40.41 IC3.27 54.36,40.21
N$30
  Top 0.406: JP4.6 64.77,5.11 64.77,7.62 65.53,8.38 68.33,8.38 69.39,9.45 69.39,40.34 67.56,42.16 56.9,42.16 56.64,41.91 56.64,40.46 IC3.28
N$33
  Bottom 0.305: IC3.4 49.05,49.55 49.53,50.04 51.16,50.04 51.82,51.05 58.42,51.05 59.44,52.07 59.44,53.14 JP6.3
N$34
  Bottom 0.406: FTDI.6 6.63,49.05 7.62,50.04 7.62,52.07 8.38,52.83 10.95,52.83
  Bottom 0.61: 10.95,52.83 C10.1
N$36
  Bottom 0.305: IC3.11 31.27,49.3 31.83,49.84 48.26,49.84 49.28,50.8 50.55,50.8 51.66,51.99 51.82,53.14 JP6.6
N$37  (via drill 0.6)
  Top 0.305: JP6.7 49.48,52.27 48.26,51.05 44.96,51.05 44.2,50.29 43.43,50.29 42.67,49.53 v42.67,45.97
  Bottom 0.305: v42.67,45.97 30.23,45.97 29.21,46.99 29.21,47.57 IC3.12
N$38  (via drill 0.6)
  Top 0.305: JP6.8 46.94,52.78 45.97,51.82 44.45,51.82 43.69,51.05 42.93,51.05 42.16,50.29 41.15,50.29 40.13,49.28 v40.08,44.81
  Bottom 0.305: v40.08,44.81 29.26,44.81 28.78,45.39 28.78,45.44 28.73,45.49 27.28,45.49 26.67,45.47 26.29,45.82 26.26,47.17 IC3.13
N$39
  Top 0.305: IC3.14 23.62,48.08 23.62,54.36 24.64,55.37 42.16,55.37 42.93,54.61 42.93,53.42 JP7.1
N$40
  Bottom 0.305: JP7.2 39.88,52.71 39.88,51.05 39.32,50.5 22.35,50.5 21.84,49.99 21.84,40.89 22.35,40.39 23.6,40.39 IC3.15
N$41
  Bottom 0.305: JP7.3 37.95,51.71 37.41,51.16 21.59,51.16 20.85,50.42 20.83,39.12 21.59,38.35 25.4,38.35 26.19,39.14 IC3.16
N$44  (via drill 0.6)
  other vias: 45.75,22.89
PIN3
  Top 0.406: JP6.4 57.1,53.04 54.1,50.04 53.34,50.04 52.83,49.53 52.83,46.48 52.32,45.97 46.74,45.97 46.48,46.23 46.48,48.03 IC3.5 46.48,48.08
PIN4
  Top 0.305: 45.21,50.04 44.45,49.28 44.45,48.54 IC3.6
  Top 0.406: JP6.5 54.56,52.02 53.59,51.05 52.83,51.05 51.82,50.04 45.21,50.04 | IC3.6 43.94,48.03 | IC3.6 43.94,48.08 | JP1.1 58.34,43.46 57.1,44.7 45.24,44.7 44.17,45.77 44.17,47.85 IC3.6
RESET  (via drill 0.6)
  Top 0.406: C10.2 16.08,52.76 16.76,52.07 JP10.2 JP10.1 | JP10.1 16.76,42.6 ICSP.5 | v22.86,44.45 19.56,44.45 18.8,45.21 18.8,45.97 18.11,46.66 JP10.1
  Bottom 0.305: IC3.1 56.64,48.03 56.64,46.23 54.1,43.69 28.96,43.69 28.19,44.45 v22.86,44.45
  Bottom 0.406: R9.1 26.8,32.13 25.4,30.73 25.4,30.48 | JP5.1 33.78,5.66 33.78,13.16 32.94,14.02 31.04,14.02 29.72,15.37 29.72,20.57 28.96,21.34 26.16,21.34 25.4,22.1 25.4,30.48 | 16.79,42.9 ICSP.5 | 16.79,42.9 16.76,42.93 | 25.4,30.48 25.15,30.73 11.68,30.73 10.67,31.75 10.67,42.67 11.43,43.43 16.26,43.43 16.79,42.9
RXD
  Top 0.406: IC3.2 54.36,48.29 54.36,48.77 55.63,50.04 61.72,50.04 64.72,53.04 JP6.1 64.77,53.39 64.77,55.88 64.26,56.39 16.97,56.46 15.29,56.46 R11.1
RXDIN
  Top 0.406: R11.2 7.67,45.06 6.6,43.99 4.52,43.99 FTDI.4
SCK
  Top 0.305: JP7.6 30.33,51.92 29.21,51.05 25.65,51.05 24.89,50.29 24.89,37.34 | 30.71,37.34 31.98,38.61 33.27,38.61 33.78,39.12 33.78,40.41 IC3.19
  Top 0.406: 30.71,37.34 24.89,37.34 18.01,37.34 ICSP.3
TXD
  Bottom 0.305: JP6.2 62.18,52.53 59.69,50.04 | 59.69,50.04 52.83,50.04 51.56,48.77 51.56,48.08 | JP1.3 60.99,48.74 59.69,50.04
  Bottom 0.406: 51.56,48.08 IC3.3 | JP6.2 62.23,53.39 62.23,55.25 61.29,56.85 17.98,56.85 16.76,55.7 16.76,52.83 13.97,50.04 11.68,50.04 10.8,49.15 10.8,47.62 9.68,46.51 FTDI.5
USBVIN
  Bottom 0.61: FTDI.3 6.58,41.43 7.11,40.89 7.11,23.11 6.6,22.61 3.81,22.61 3.3,22.1 3.3,19.18 JP12.3
VIN
  Top 0.61: 17.6,5.08 D2.C | 27.94,2.54 20.78,2.54 D2.C | 27.94,2.54 45.72,2.54 47.09,3.91 47.09,5.05 JP5.6 | 27.94,2.54 27.38,3.1 JP2.2 27.38,6.65 26.67,7.49 25.2,7.49 24.46,8.23 U$2.P$1 | C6.+ 12.5,20.02 13.72,18.8 13.72,14.73 13.08,14.1 | 13.08,14.1 11.68,12.7 11.22,12.7 U$3.TIP | 13.08,14.1 13.72,13.46 13.72,11.84 15.57,9.98 16.61,9.98 18.24,8.36 18.24,5.08 D2.C

### Text on the board
tNames: AREF | GND | 13 | 12 | 11 | 10 | 09 | 08 | 07 | 06 | 05 | 04 | 03 | 02 | TX | RX | RTS# | 1 | RXD | reset | disable | PIN SELECT | TXD | ATMEGA328 | 4 | +5V | GND | 1 | FLUXAMASYNTH | www.moderndevice.com | REV 1.0 | USB | VIN | SELECT | VIN | LM3941 | +5V | +3V3 | LM3941 | + | GND | VIN | RST | 3V3 | 5V | GND | GND | VIN | A0 | A1 | A2 | A3 | A4 | A5